# EAGLE design PWM 555 (EAGLE 6.3)
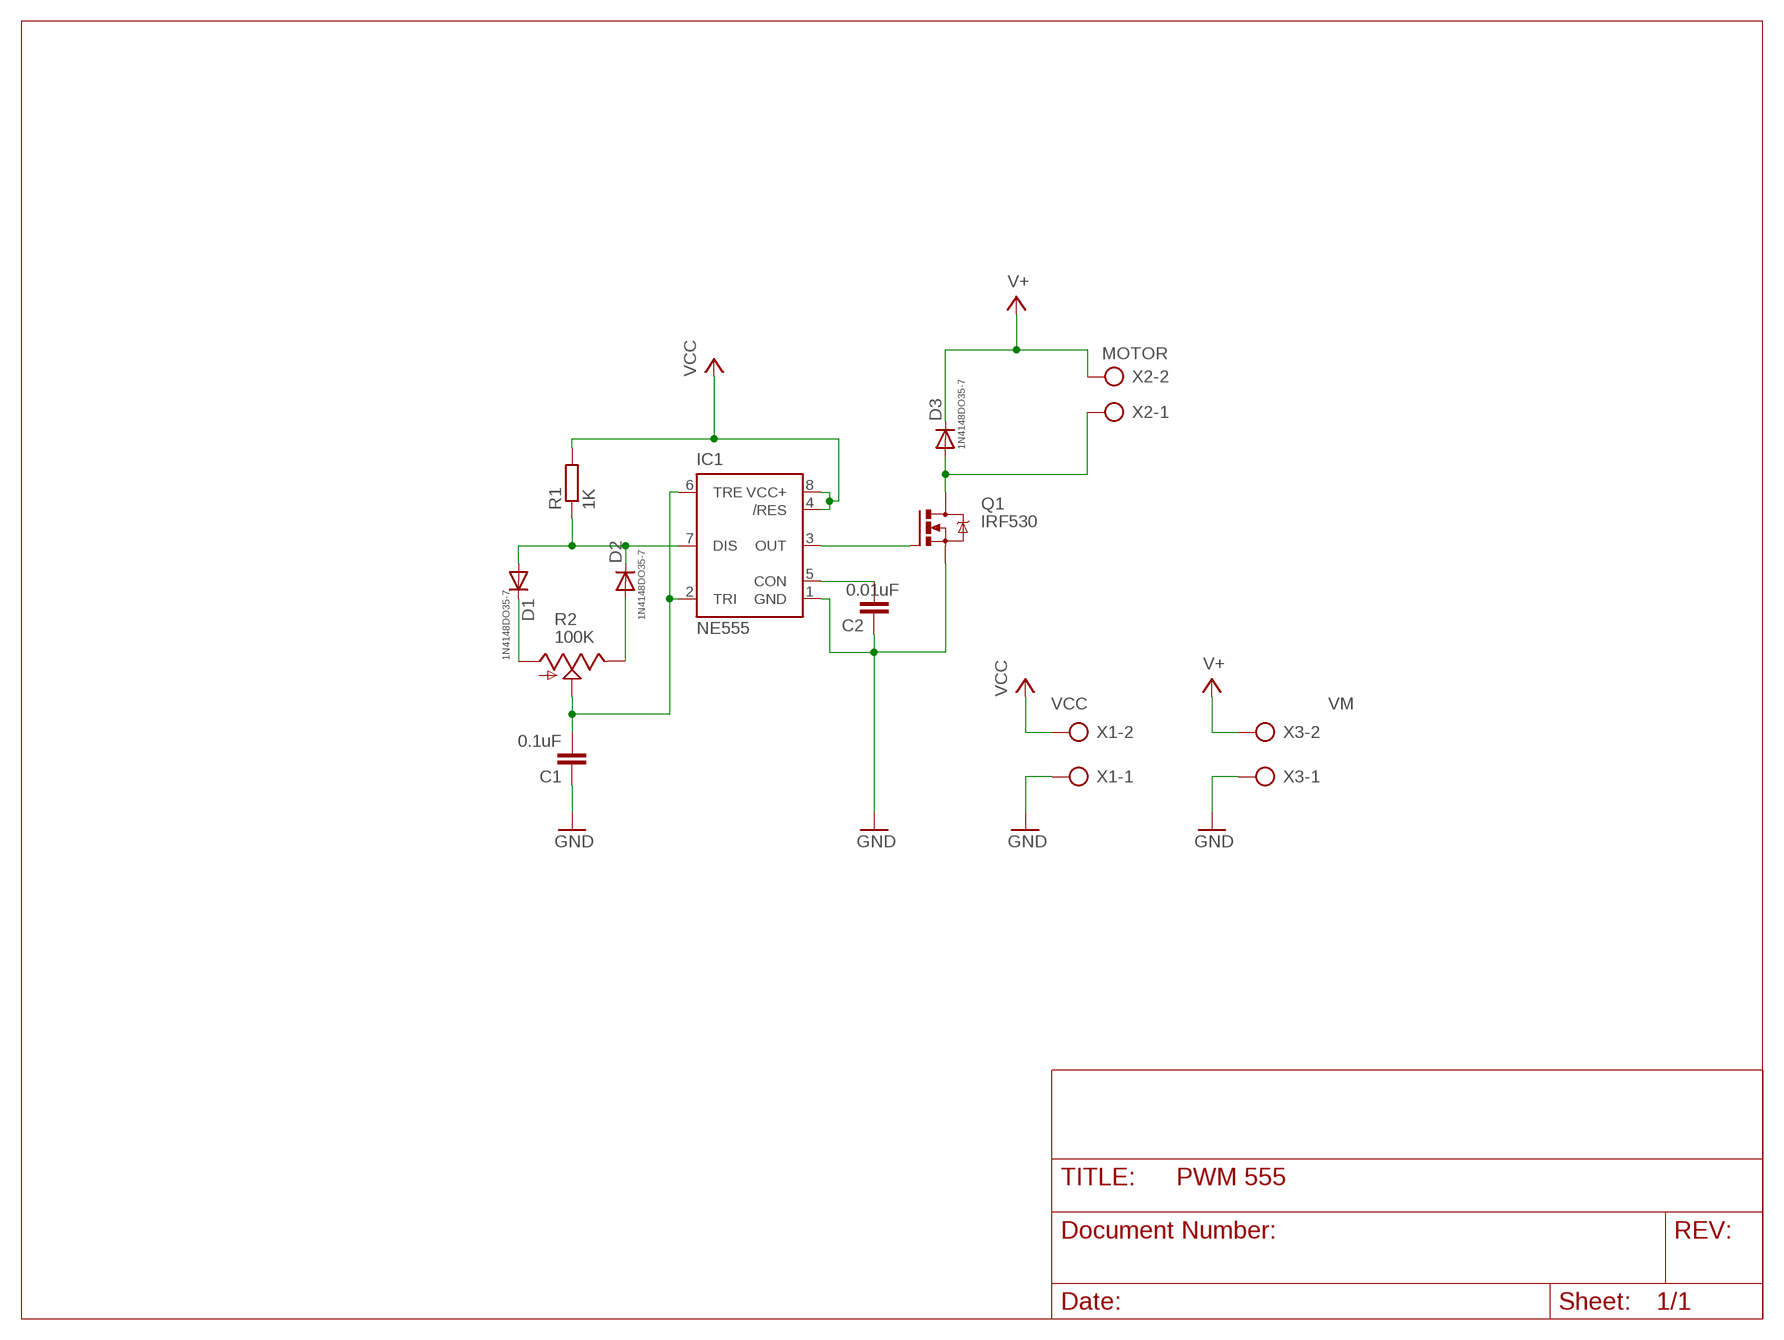
[diagram p0: schematic, sheet 1]

## Parts
C1  0.1uF  C-EU025-024X044  [C025-024X044]
C2  0.01uF  C-EU025-024X044  [C025-024X044]
D1  1N4148DO35-7  [DO35-7]
D2  1N4148DO35-7  [DO35-7]
D3  1N4148DO35-7  [DO35-7]
IC1  NE555  [DIL-08]
Q1  IRF530  [TO220BV]
R1  1K  R-EU_0207/7  [0207/7]
R2  100K  TRIM_US-S63S  [S63S]
X1  VCC  AK500/2-H  [AK500/2-H]
X2  MOTOR  AK500/2-H  [AK500/2-H]
X3  VM  AK500/2-H  [AK500/2-H]

## Nets
GND [Power]: C1.1 C2.1 IC1.1(GND) Q1.S X1.1 X3.1
N$1: D1.A D2.C IC1.7(DIS) R1.1
N$2: C1.2 IC1.2(TRI) IC1.6(TRE) R2.S
N$4: D1.C R2.A
N$5: D2.A R2.E
N$7: IC1.3(OUT) Q1.G
N$8: C2.2 IC1.5(CON)
N$9 [Power]: D3.A Q1.D X2.1
V+ [Power]: D3.C X2.2 X3.2
VCC: IC1.4(/RES) IC1.8(VCC+) R1.2 X1.2

## Library data of the parts
C1 C2 = rcl:C-EU: CAPACITOR, European symbol
D1-D3 = diode:1N4148: DIODE high speed (Philips)
IC1 = st-microelectronics:NE555: General purpose bipolar Timer; MF: Arrow Electronics; MPN: NE555N; OC_FARNELL: 1467742; OC_NEWARK: 89K1486
Q1 = transistor-power:IRF530: HEXFET Power MOSFET
R1 = rcl:R-EU_: RESISTOR, European symbol
R2 = pot:TRIM_US-: POTENTIOMETER
X1-X3 = con-ptr500:AK500/2-H: CONNECTOR Aug. 2004 / PTR Meßtechnik: Die Bezeichnung der Serie AK505 wurde geändert. Es handelt sich hierbei um AK500 in horizontaler Ausführung.; OC_FARNELL: unknown; OC_NEWARK: unknown

## Net classes
0 default: width 0.813 mm
1 Power: width 1.27 mm

## Board
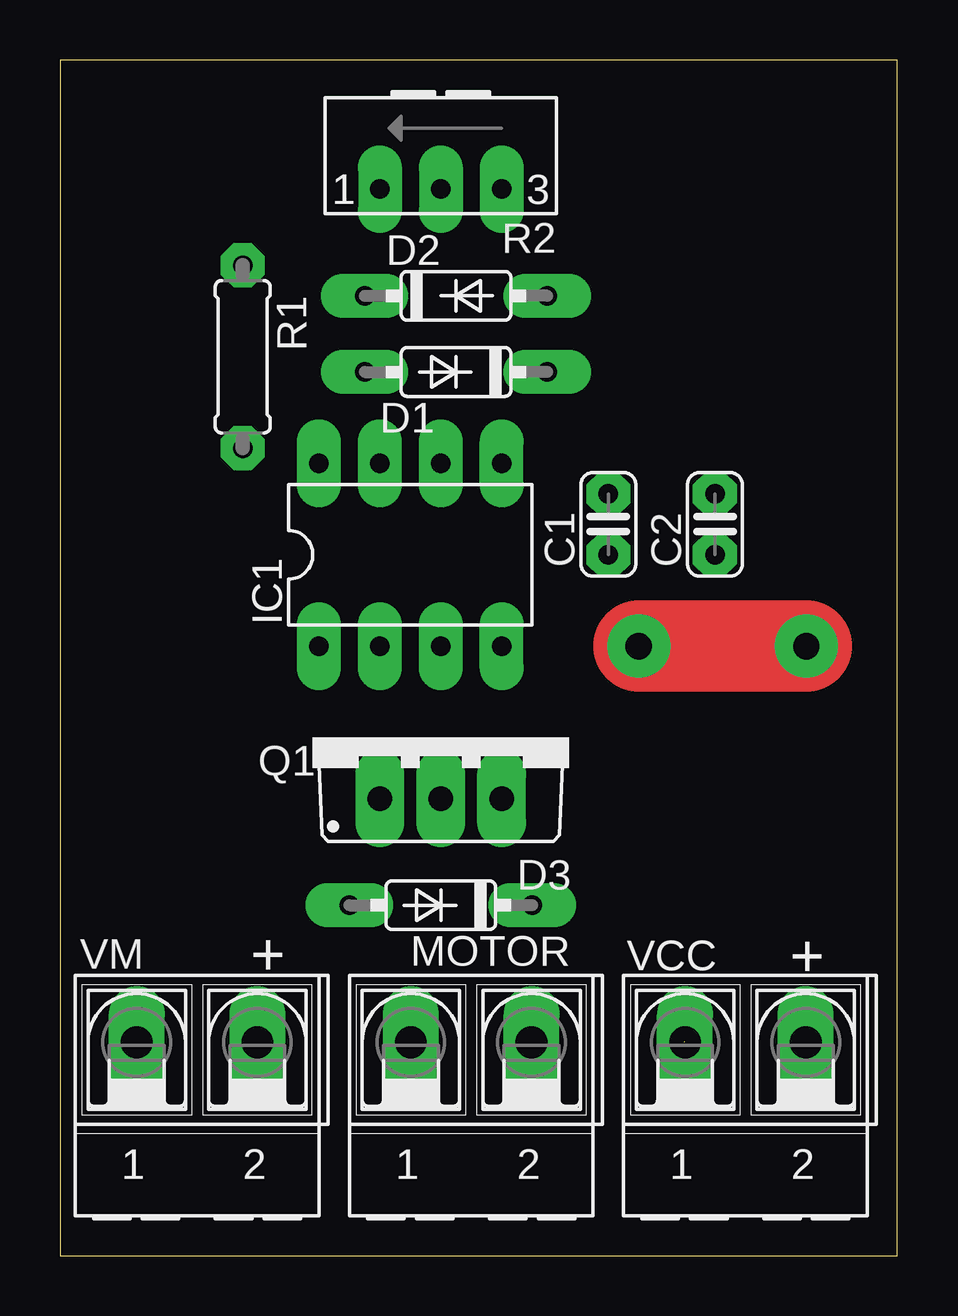
[diagram p1: board, top side]
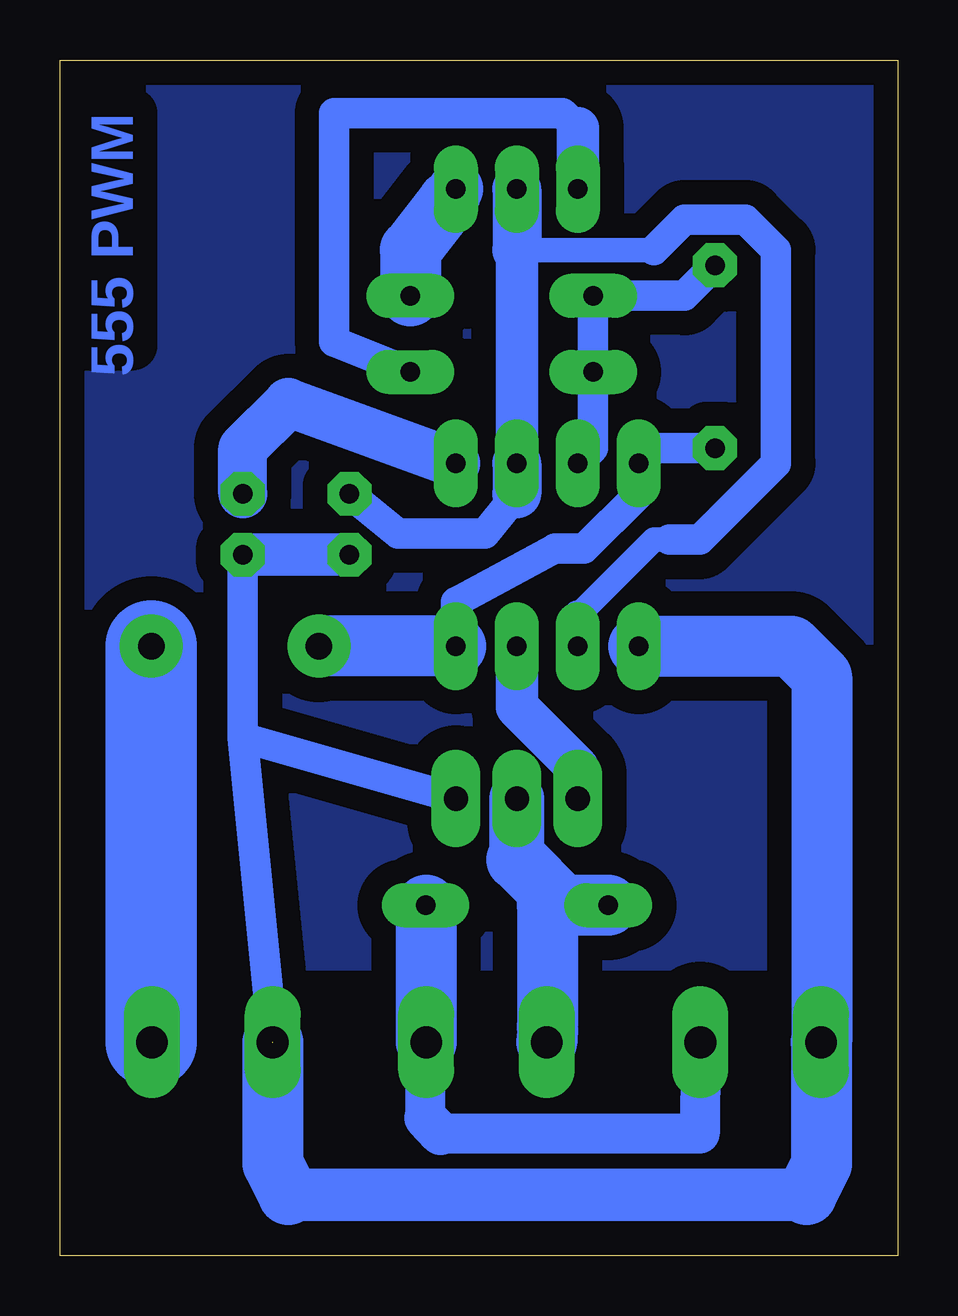
[diagram p2: board, bottom side, seen from below]

Size 34.91 x 49.84 mm. Coordinates in mm from the lower left corner, seen from the top.
Outline: 0,0 34.91,0 34.91,49.84 0,49.84 0,0
Copper layers (1*16): Top 0.035mm / dielectric 1.5mm / Bottom 0.035mm
Design rules "default *": minimum track width 40mil, minimum drill 50mil, track to track 12mil, track to pad 12mil, pad to pad 12mil, via to via 12mil, smd to smd 12mil, copper to edge 40mil, drill to drill 8mil, minimum pad ring 20mil, minimum via ring 30mil, stop-mask expansion 4mil, vias tented up to drill 0mil, thermal gap 10mil

### Footprints (pad centres in the part's own frame; a part is rotated, then mirrored left to right if it is on the bottom)
C025-024X044 = drill 0.813 octagon: 1 -1.27,0; 2 1.27,0
DO35-7 = drill 0.813 long: A 3.81,0; C -3.81,0
DIL-08 = drill 0.813 long: 1 -3.81,-3.81; 2 -1.27,-3.81; 3 1.27,-3.81; 4 3.81,-3.81; 5 3.81,3.81; 6 1.27,3.81; 7 -1.27,3.81; 8 -3.81,3.81
TO220BV = drill 1.016 long: D 0,-2.54; G -2.54,-2.54; S 2.54,-2.54
0207/7 = drill 0.813 octagon: 1 -3.81,0; 2 3.81,0
S63S = drill 0.813 long: A 2.54,1.27; E -2.54,1.27; S 0,1.27
AK500/2-H = drill 1.321 long: 1 -2.515,0; 2 2.515,0

### Placement (x,y rotation side)
C1  22.86,30.48 90 top
C2  27.3,30.48 90 top
D1  16.51,36.83 180 top
D2  16.51,40.01 0 top
D3  15.88,14.61 180 top
IC1  14.61,29.21 0 top
Q1  15.88,21.59 0 top
R1  7.62,37.47 270 top
R2  15.88,45.72 180 top
X1  28.57,8.89 0 top
X2  17.14,8.89 0 top
X3  5.71,8.89 0 top

### Tracks (layer width: path | path; a pad name or v marks a point on that pad's centre or on a via)
GND  (1 unrouted)
  Bottom 1.27: C2.1 27.3,21.59 | Q1.S 27.3,21.59 | 27.3,21.59 26.04,8.91
  Bottom 1.778: C1.1 C2.1
  Bottom 2.184: 25.4,2.54 3.81,2.54
  Bottom 2.54: IC1.1 4.45,25.4 3.17,24.13 3.17,8.91 X3.1 3.17,8.87 3.17,3.81 3.81,2.54 | X1.1 26.06,3.83 25.4,2.54
N$1
  Bottom 1.27: IC1.7 12.7,33.66 D1.A D2.C 8.89,40.01 R1.1
N$2
  Bottom 1.016: 10.16,41.91 15.88,41.91 | 13.34,26.67 10.16,29.84 9.53,29.84
  Bottom 1.27: 15.88,31.75 17.21,30.1 20.83,30.1 C1.2 | IC1.2 13.34,26.67 | 9.53,29.84 8.26,29.84 5.08,33.02 5.08,41.91 6.35,43.18 8.89,43.18 10.16,41.91
  Bottom 1.778: 15.88,41.91 IC1.6
  Bottom 2.032: IC1.6 15.88,31.75 | R2.S 15.88,41.91
N$4
  Bottom 1.27: 13.34,46.99 13.97,47.62 23.5,47.62 23.5,38.1 D1.C
  Bottom 1.778: R2.A 13.34,46.99
N$5
  Bottom 2.286: R2.E 18.73,43.94
  Bottom 2.54: 18.73,43.94 20.32,41.91 D2.A
N$7
  Bottom 1.778: Q1.G 13.34,20.32 15.88,22.86 IC1.3
N$8
  Bottom 2.032: C2.2 27.3,33.66 25.4,35.56 IC1.5
N$9
  Bottom 2.286: 15.88,16.51 Q1.D
  Bottom 2.54: X2.1 14.61,9.55 14.61,14.61 D3.A 13.97,14.61 15.88,16.51
N$11
  pour Bottom (isolate 1.016): 0,48.9 0,12.06 34.92,12.06 34.92,48.9
V+
  Bottom 0.406: D3.C 19.66,14.61
  Bottom 1.676: 8.23,8.28 8.26,5.08 19.05,5.08 | 19.68,5.74 X2.2
  Bottom 1.778: X3.2 8.23,8.28 | 19.05,5.08 19.68,5.74
  Bottom 2.54: 19.66,14.61 X2.2
VCC  (via drill 1.1)
  Top 3.81: v31.11,25.4 v24.13,25.4
  Bottom 1.27: 31.11,8.91 X1.2 | R1.2 10.16,33.66 IC1.8 10.79,31.75 13.08,29.46 14.29,29.46 18.41,27.24 IC1.4
  Bottom 2.54: IC1.4 v24.13,25.4
  Bottom 3.81: 31.11,8.91 v31.11,25.4

### Text on the board
Bottom: 555 PWM
tNames: + | +